# EAGLE design dynalov3 (EAGLE 7.4.0)
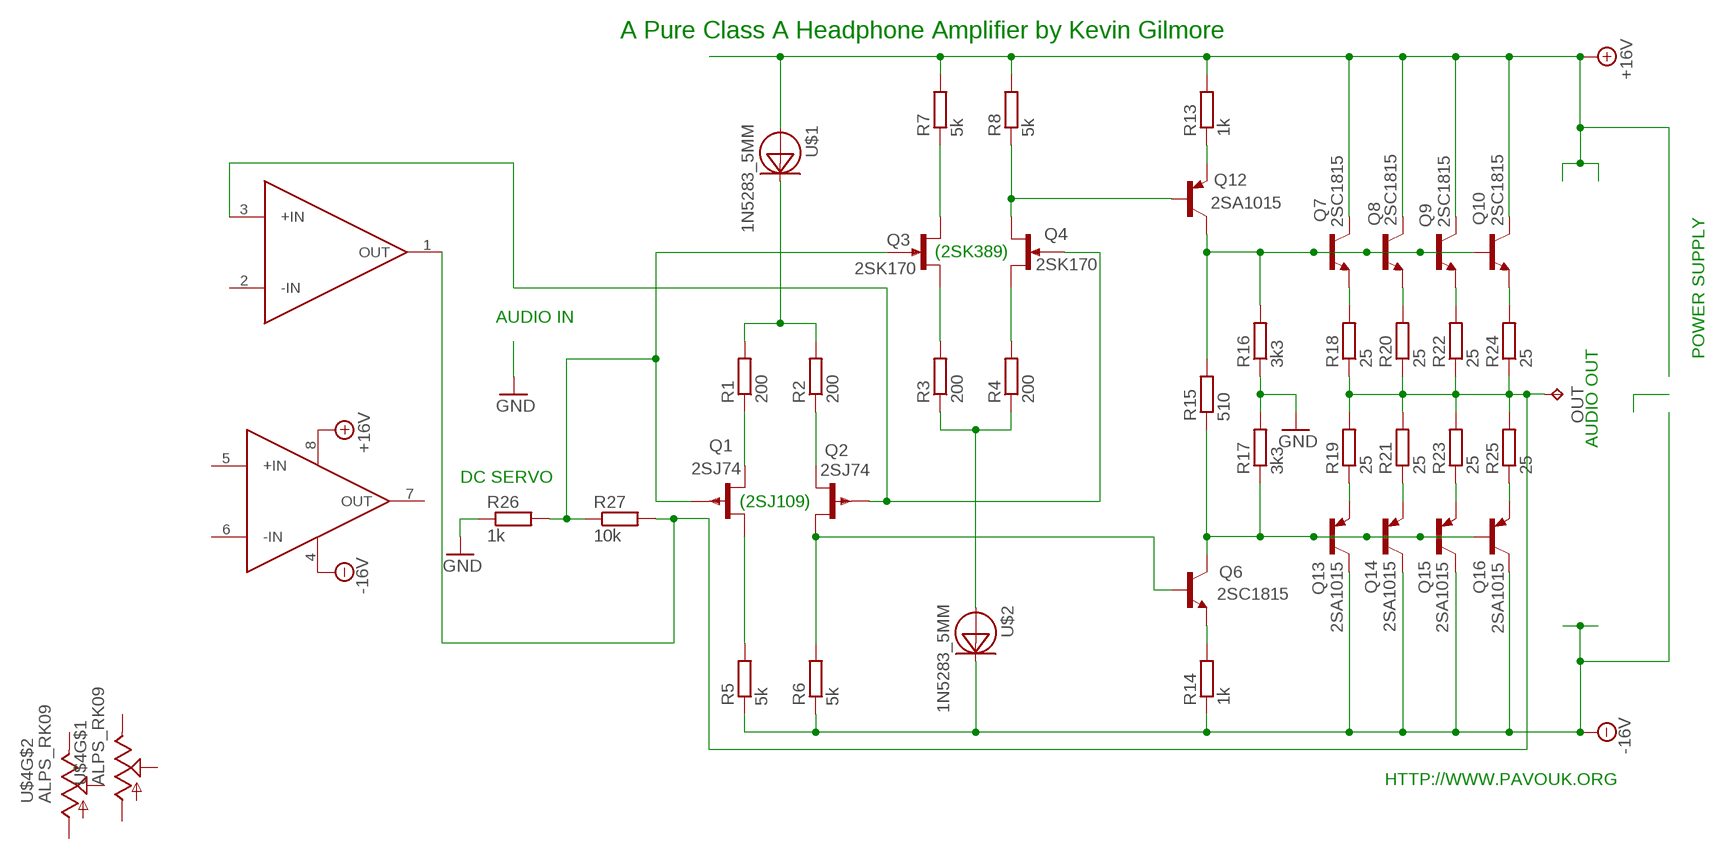
[diagram p0: schematic, sheet 1]

## Parts
OUT  TPPAD1-20  [P1-20]
Q1  2SJ74  2N3820  [TO92F]
Q2  2SJ74  2N3820  [TO92F]
Q3  2SK170  2N3819  [TO92F]
Q4  2SK170  2N3819  [TO92F]
Q6  2SC1815  [TO92-ECB]
Q7  2SC1815  [TO92-ECB]
Q8  2SC1815  [TO92-ECB]
Q9  2SC1815  [TO92-ECB]
Q10  2SC1815  [TO92-ECB]
Q12  2SA1015  -PNP-TO92-ECB  [TO92-ECB]
Q13  2SA1015  -PNP-TO92-ECB  [TO92-ECB]
Q14  2SA1015  -PNP-TO92-ECB  [TO92-ECB]
Q15  2SA1015  -PNP-TO92-ECB  [TO92-ECB]
Q16  2SA1015  -PNP-TO92-ECB  [TO92-ECB]
R1  200  R-EU_MELF0204W  [MINI_MELF-0204W]
R2  200  R-EU_MELF0204W  [MINI_MELF-0204W]
R3  200  R-EU_MELF0204W  [MINI_MELF-0204W]
R4  200  R-EU_MELF0204W  [MINI_MELF-0204W]
R5  5k  R-EU_MELF0204W  [MINI_MELF-0204W]
R6  5k  R-EU_MELF0204W  [MINI_MELF-0204W]
R7  5k  R-EU_MELF0204W  [MINI_MELF-0204W]
R8  5k  R-EU_MELF0204W  [MINI_MELF-0204W]
R13  1k  R-EU_MELF0204W  [MINI_MELF-0204W]
R14  1k  R-EU_MELF0204W  [MINI_MELF-0204W]
R15  510  R-EU_MELF0204W  [MINI_MELF-0204W]
R16  3k3  R-EU_MELF0204W  [MINI_MELF-0204W]
R17  3k3  R-EU_MELF0204W  [MINI_MELF-0204W]
R18  25  R-EU_MELF0204W  [MINI_MELF-0204W]
R19  25  R-EU_MELF0204W  [MINI_MELF-0204W]
R20  25  R-EU_MELF0204W  [MINI_MELF-0204W]
R21  25  R-EU_MELF0204W  [MINI_MELF-0204W]
R22  25  R-EU_MELF0204W  [MINI_MELF-0204W]
R23  25  R-EU_MELF0204W  [MINI_MELF-0204W]
R24  25  R-EU_MELF0204W  [MINI_MELF-0204W]
R25  25  R-EU_MELF0204W  [MINI_MELF-0204W]
R26  1k  R-EU_MELF0204W  [MINI_MELF-0204W]
R27  10k  R-EU_MELF0204W  [MINI_MELF-0204W]
U$1  1N5283_5MM  [DO-35-2]
U$2  1N5283_5MM  [DO-35-2]
U$3  LME49720  [DIL08]
U$4  ALPS_RK09  [RK09]

## Nets
+15V: Q7.C Q8.C Q9.C Q10.C R7.2 R8.2 R13.2 U$1.ANODE U$3.8(V+) ; supply symbol labelled +16V
-15V: Q13.C Q14.C Q15.C Q16.C R5.1 R6.1 R14.1 U$2.CATHODE U$3.4(V-) ; supply symbol labelled -16V
GND: R16.1 R17.2 R26.1
N$1: OUT.TP R18.1 R19.2 R20.1 R21.2 R22.1 R23.2 R24.1 R25.2 R27.2 U$3.1(OUT)
N$2: Q7.E R18.2
N$3: Q8.E R20.2
N$4: Q9.E R22.2
N$5: Q10.E R24.2
N$6: Q13.E R19.1
N$7: Q14.E R21.1
N$8: Q15.E R23.1
N$9: Q16.E R25.1
N$11: Q7.B Q8.B Q9.B Q10.B Q12.C R15.2 R16.2
N$13: Q6.C Q13.B Q14.B Q15.B Q16.B R15.1 R17.1
N$14: Q12.E R13.1
N$15: Q6.E R14.2
N$18: R3.1 R4.1 U$2.ANODE
N$19: Q3.D R7.1
N$20: Q3.S R3.2
N$21: Q4.D R4.2
N$22: Q4.S Q12.B R8.1
N$23: Q1.D R1.1
N$24: Q2.D Q6.B R6.2
N$25: Q2.S R2.1
N$26: Q1.S R5.2
N$27: R1.2 R2.2 U$1.CATHODE
N$28: Q1.G Q3.G R26.2 R27.1
N$29: Q2.G Q4.G U$3.3(+IN)
Unconnected: U$3.2(-IN) U$3.5(+IN) U$3.6(-IN) U$3.7(OUT) U$4.G1 U$4.G2 U$4.I1 U$4.I2 U$4.O1 U$4.O2

## Notes on the sheet
- A Pure Class A Headphone Amplifier by Kevin Gilmore
- (2SK389)
- AUDIO IN
- POWER SUPPLY
- AUDIO OUT
- DC SERVO
- (2SJ109)
- HTTP://WWW.PAVOUK.ORG

## Library data of the parts
OUT = testpad:TP: Test pad
Q1 Q2 = transistor-small-signal:2N3820: P-CHANNEL FET
Q3 Q4 = transistor-small-signal:2N3819: N-CHANNEL FET
Q6-Q10 = transistor:2SC1815: NPN EPITAXIAL TRANSISTOR Source: TOSHIBA .. 2SC1815 1.pdf
Q12-Q16 = transistor-neu-to92:*-PNP-: PNP Transistror
R1-R8 R13-R27 = resistor:R-EU_: RESISTOR, European symbol
U$1 U$2 = crd:1N5283: 0.22 mA through 4.23 mA current regulating diode series
U$3 = Vwvwbg:LME49720
U$4 = audio-pots:ALPS_RK09

## Board
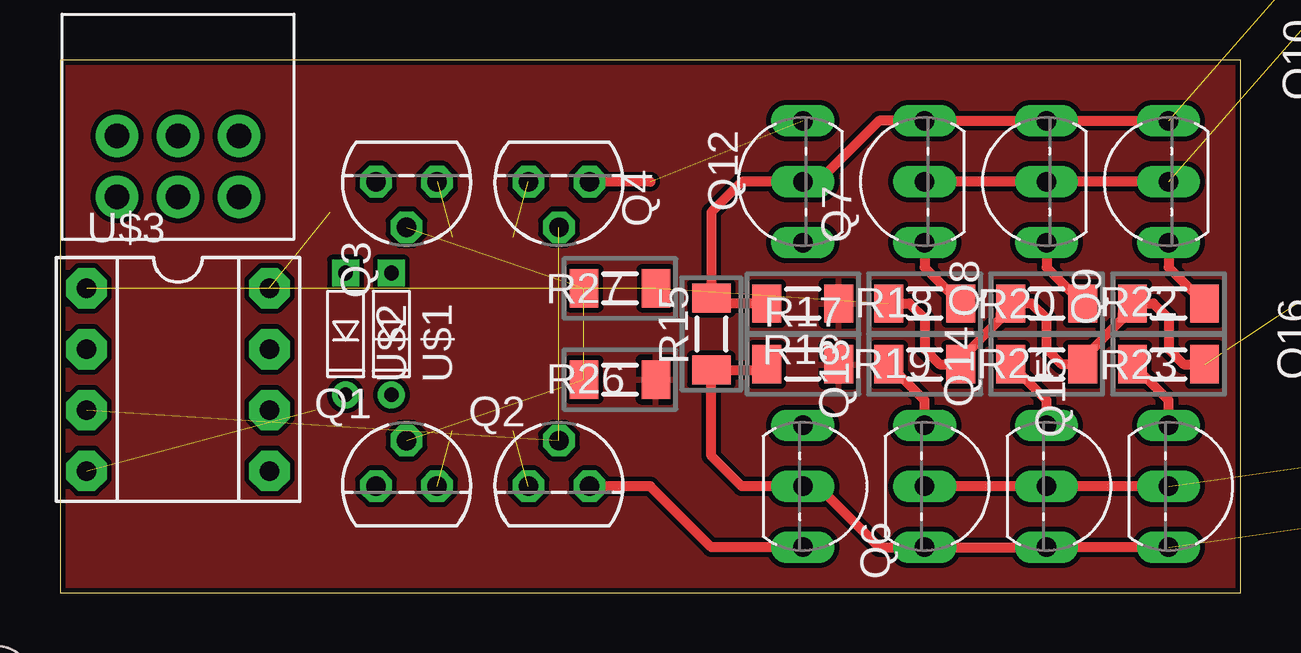
[diagram p1: board, top side]
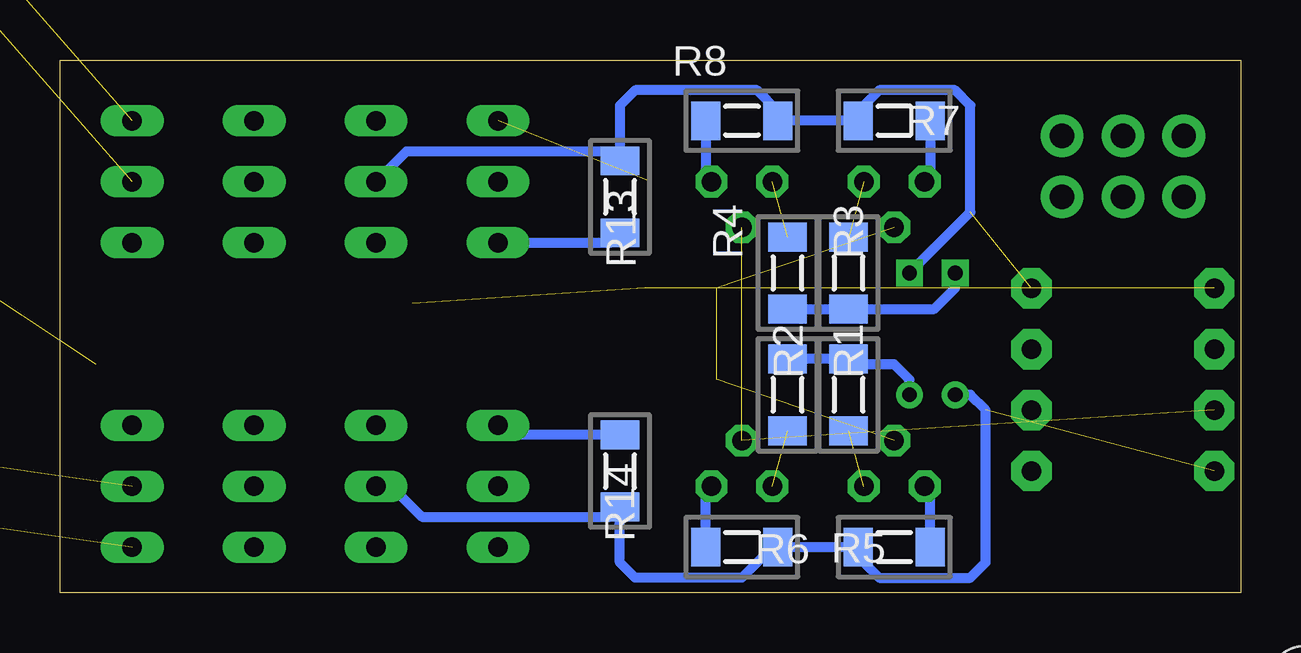
[diagram p2: board, bottom side, seen from below]

Size 49.2 x 22.21 mm. Coordinates in mm from the lower left corner, seen from the top.
Outline: 0,0 49.2,0 49.2,22.21 0,22.21 0,0
Copper layers (1*16): Top 0.035mm / dielectric 1.5mm / Bottom 0.035mm
Design rules "default *": minimum track width 10mil, minimum drill 24mil, track to track 8mil, track to pad 8mil, pad to pad 8mil, via to via 8mil, smd to smd 8mil, copper to edge 8mil, drill to drill 8mil, minimum pad ring 10mil, minimum via ring 8mil, stop-mask expansion 4mil, vias tented up to drill 0mil, thermal gap 10mil
Holes 3.2 mm at 2.38,53.34 -2.71,-3.81 77.3,53.34 77.3,2.54

### Footprints (pad centres in the part's own frame; a part is rotated, then mirrored left to right if it is on the bottom)
P1-20 = drill 2.007 pad 3.15 octagon: TP 0,0
TO92F = drill 0.813 octagon: D 1.27,0; G 0,1.905; S -1.27,0
TO92-ECB = drill 0.813 long: B 2.54,0; C 0,0; E -2.54,0
MINI_MELF-0204W = smd 1.2 x 1.6: 1 -1.5,0; 2 1.5,0
DO-35-2 = drill 0.61 square: ANODE -2.54,0 | drill 0.61: CATHODE 2.54,0
DIL08 = drill 0.813 pad 1.676 octagon: 1 -3.81,-3.81; 2 -1.27,-3.81; 3 1.27,-3.81; 4 3.81,-3.81; 5 3.81,3.81; 6 1.27,3.81; 7 -1.27,3.81; 8 -3.81,3.81
RK09 = drill 1.016 pad 1.778: G1 0,-2.54; G2 -2.54,-2.54; I1 0,2.54; I2 -2.54,2.54; O1 0,0; O2 -2.54,0

### Placement (x,y rotation side)
OUT  57.62,15.87 270 top  (outside the outline)
Q1  14.44,4.44 0 top
Q2  20.79,4.44 0 top
Q3  14.44,17.14 180 top
Q4  20.79,17.14 180 top
Q6  30.95,4.44 270 top
Q7  36.03,17.14 90 top
Q8  41.11,17.14 90 top
Q9  46.19,17.14 90 top
Q10  55.08,27.3 90 top  (outside the outline)
Q12  30.95,17.14 90 top
Q13  36.03,4.44 270 top
Q14  41.11,4.44 270 top
Q15  46.19,4.44 270 top
Q16  55.08,5.71 270 top  (outside the outline)
R1  16.35,8.25 90 bottom
R2  18.89,8.25 90 bottom
R3  16.35,13.33 90 bottom
R4  18.89,13.33 90 bottom
R5  14.44,1.9 0 bottom
R6  20.79,1.9 180 bottom
R7  14.44,19.68 180 bottom
R8  20.79,19.68 0 bottom
R13  25.87,16.51 90 bottom
R14  25.87,5.08 90 bottom
R15  27.14,10.79 90 top
R16  30.95,12.06 180 top
R17  30.95,9.52 0 top
R18  36.03,12.06 0 top
R19  36.03,9.52 0 top
R20  41.11,12.06 0 top
R21  41.11,9.52 0 top
R22  46.19,12.06 0 top
R23  46.19,9.52 0 top
R24  55.08,19.68 90 top  (outside the outline)
R25  53.81,12.06 90 top  (outside the outline)
R26  23.33,8.88 180 top
R27  23.33,12.69 0 top
U$1  13.81,10.79 270 top
U$2  11.9,10.79 270 top
U$3  4.92,8.88 270 top
U$4  4.92,19.05 90 top

### Tracks (layer width: path | path; a pad name or v marks a point on that pad's centre or on a via)
+15V  (2 unrouted)
  Top 0.406: Q9.C Q8.C Q7.C
  Bottom 0.406: U$1.ANODE 11.27,15.87 11.27,20.32 11.9,20.95 15.08,20.95 15.71,20.32 15.71,19.91 R7.2 R8.2 19.29,20.09 20.16,20.95 25.23,20.95 25.87,20.32 R13.2 26.28,18.41 34.76,18.41 Q7.C
-15V  (2 unrouted)
  Top 0.406: Q15.C Q14.C Q13.C
  Bottom 0.406: U$2.CATHODE 11.27,8.25 10.63,7.62 10.63,1.27 11.27,0.63 15.08,0.63 15.94,1.5 R5.1 R6.1 19.52,1.9 20.79,0.63 25.23,0.63 25.87,1.27 R14.1 26.28,3.17 34.12,3.17 35.4,4.44 Q13.C
GND
  pour Top: -0.17,29.21 49.37,29.21 49.37,-0.01 -0.17,-0.01
N$1  (5 unrouted)
  Top 0.406: R18.1 35.4,12.06 36.03,11.42 36.03,10.15 36.66,9.52 R19.2 37.53,9.75 39.2,11.42 39.2,11.65 R20.1 40.48,12.06 41.11,11.42 41.11,10.15 41.74,9.52 R21.2 42.61,9.75 44.29,11.42 44.29,11.65 R22.1 45.55,12.06 46.19,11.42 46.19,10.15 46.83,9.52 R23.2
N$2
  Top 0.406: Q7.E 36.03,13.56 R18.2
N$3
  Top 0.406: Q8.E 41.11,13.56 R20.2
N$4
  Top 0.406: Q9.E 46.19,13.56 R22.2
N$5  (1 unrouted)
N$6
  Top 0.406: Q13.E 36.03,8.02 R19.1
N$7
  Top 0.406: Q14.E 41.11,8.02 R21.1
N$8
  Top 0.406: Q15.E 46.19,8.02 R23.1
N$9  (1 unrouted)
N$11  (1 unrouted)
  Top 0.406: Q9.B Q8.B Q7.B 34.12,19.68 31.59,17.14 Q12.C 28.41,17.14 27.14,15.87 R15.2 27.37,12.06 R16.2
N$13  (1 unrouted)
  Top 0.406: Q15.B Q14.B Q13.B 34.12,1.9 31.59,4.44 Q6.C 28.41,4.44 27.14,5.71 R15.1 29.22,9.29 R17.1
N$14
  Bottom 0.406: Q12.E 26.28,14.6 R13.1
N$15
  Bottom 0.406: R14.2 30.55,6.58 Q6.E
N$18
  Bottom 0.406: R4.1 R3.1 12.77,11.83 11.9,12.69 U$2.ANODE
N$19
  Bottom 0.406: R7.1 12.94,17.37 Q3.D
N$20  (1 unrouted)
N$21  (1 unrouted)
N$22  (1 unrouted)
  Top 0.406: 24.6,17.14 Q4.S
  Bottom 0.406: R8.1 22.29,17.37 Q4.S
N$23  (1 unrouted)
N$24
  Top 0.406: Q6.B 27.14,1.9 24.6,4.44 Q2.D
  Bottom 0.406: R6.2 22.29,4.21 Q2.D
N$25  (1 unrouted)
N$26
  Bottom 0.406: R5.2 12.94,4.21 Q1.S
N$27
  Bottom 0.406: R2.2 R1.2 16.12,9.52 14.44,9.52 13.81,8.88 U$1.CATHODE
N$28  (3 unrouted)
N$29  (2 unrouted)